# Altium schematic sheet GREENLED.SchDoc
size A
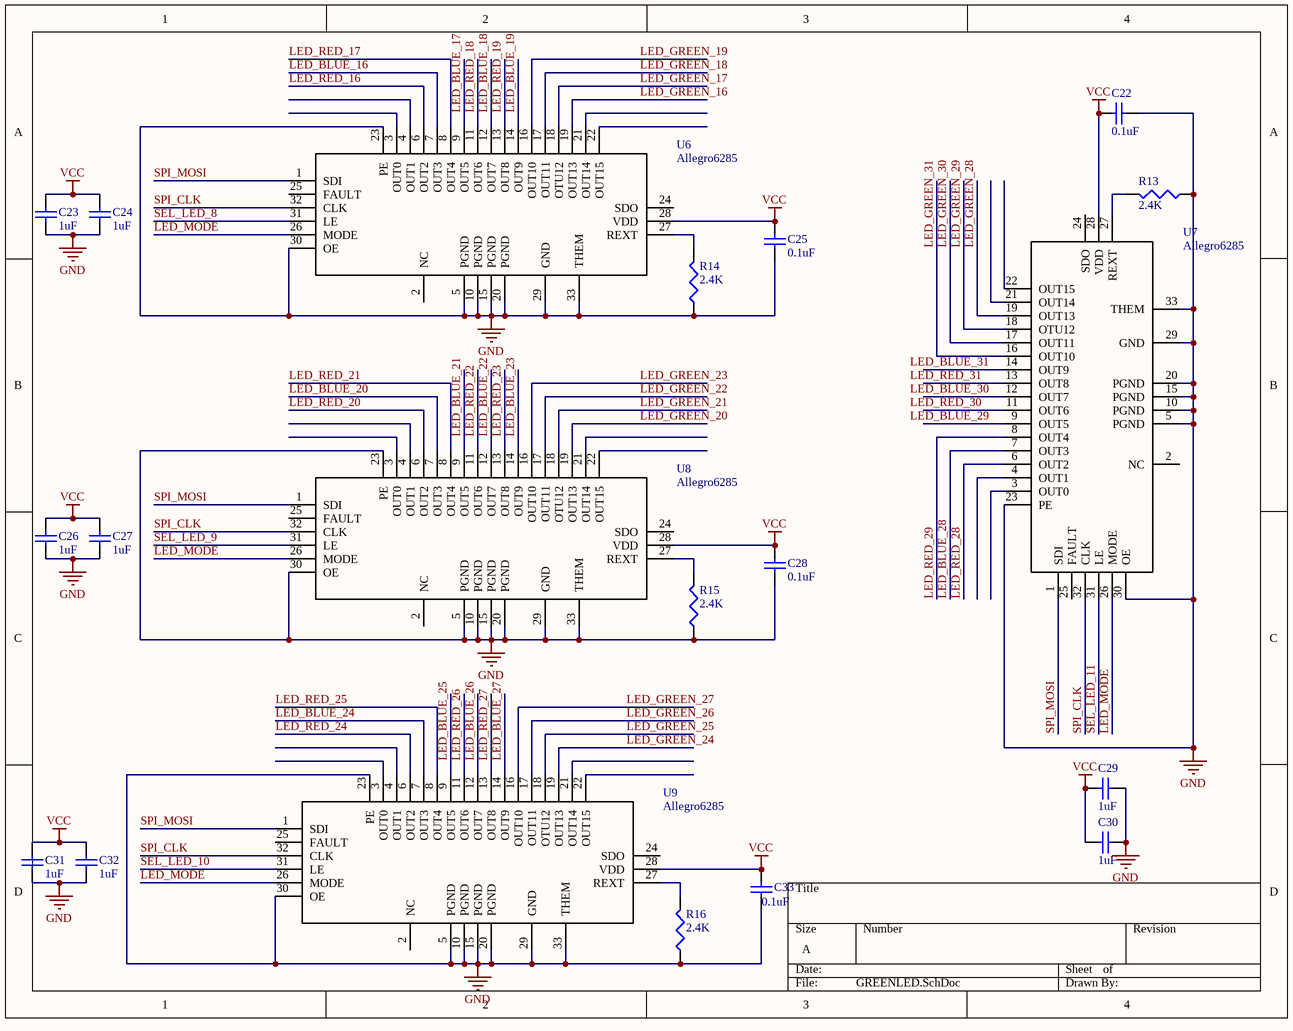
[diagram p0: GREENLED.SchDoc]

## Parts
C22  value 0.1uF  [CAPC1005L]  (hidden comment: Cap Semi)
C23  value 1uF  [CAPC1608L]  (hidden comment: Cap Semi)
C24  value 1uF  [CAPC1608L]  (hidden comment: Cap Semi)
C25  value 0.1uF  [CAPC1005L]  (hidden comment: Cap Semi)
C26  value 1uF  [CAPC1608L]  (hidden comment: Cap Semi)
C27  value 1uF  [CAPC1608L]  (hidden comment: Cap Semi)
C28  value 0.1uF  [CAPC1005L]  (hidden comment: Cap Semi)
C29  value 1uF  [CAPC1608L]  (hidden comment: Cap Semi)
C30  value 1uF  [CAPC1608L]  (hidden comment: Cap Semi)
C31  value 1uF  [CAPC1608L]  (hidden comment: Cap Semi)
C32  value 1uF  [CAPC1608L]  (hidden comment: Cap Semi)
C33  value 0.1uF  [CAPC1005L]  (hidden comment: Cap Semi)
R13  value 2.4K  [RESC1608L]  (hidden comment: Res3)
R14  value 2.4K  [RESC1608L]  (hidden comment: Res3)
R15  value 2.4K  [RESC1608L]  (hidden comment: Res3)
R16  value 2.4K  [RESC1608L]  (hidden comment: Res3)
U6  Allegro6285  [QFN-32]
U7  Allegro6285  [QFN-32]
U8  Allegro6285  [QFN-32]
U9  Allegro6285  [QFN-32]

## Nets
GND: C22.1 C23.1 C24.1 C25.1 C26.1 C27.1 C28.1 C29.1 C30.1 C31.1 C32.1 C33.1 R13.1 R14.1 R15.1 R16.1 U6.5(PGND) U6.10(PGND) U6.15(PGND) U6.20(PGND) U6.23(PE) U6.29(GND) U6.30(OE) U6.33(THEM) U7.5(PGND) U7.10(PGND) U7.15(PGND) U7.20(PGND) U7.23(PE) U7.29(GND) U7.30(OE) U7.33(THEM) U8.5(PGND) U8.10(PGND) U8.15(PGND) U8.20(PGND) U8.23(PE) U8.29(GND) U8.30(OE) U8.33(THEM) U9.5(PGND) U9.10(PGND) U9.15(PGND) U9.20(PGND) U9.23(PE) U9.29(GND) U9.30(OE) U9.33(THEM)
VCC: C22.2 C23.2 C24.2 C25.2 C26.2 C27.2 C28.2 C29.2 C30.2 C31.2 C32.2 C33.2 U6.28(VDD) U7.28(VDD) U8.28(VDD) U9.28(VDD)
LED_BLUE_16: U6.7(OUT3)
LED_BLUE_17: U6.9(OUT5)
LED_BLUE_18: U6.12(OUT7)
LED_BLUE_19: U6.14(OUT9)
LED_BLUE_20: U8.7(OUT3)
LED_BLUE_21: U8.9(OUT5)
LED_BLUE_22: U8.12(OUT7)
LED_BLUE_23: U8.14(OUT9)
LED_BLUE_24: U9.7(OUT3)
LED_BLUE_25: U9.9(OUT5)
LED_BLUE_26: U9.12(OUT7)
LED_BLUE_27: U9.14(OUT9)
LED_BLUE_28: U7.7(OUT3)
LED_GREEN_16: U6.19(OUT13)
LED_GREEN_17: U6.18(OTU12)
LED_GREEN_18: U6.17(OUT11)
LED_GREEN_19: U6.16(OUT10)
LED_GREEN_20: U8.19(OUT13)
LED_GREEN_21: U8.18(OTU12)
LED_GREEN_22: U8.17(OUT11)
LED_GREEN_23: U8.16(OUT10)
LED_GREEN_24: U9.19(OUT13)
LED_GREEN_25: U9.18(OTU12)
LED_GREEN_26: U9.17(OUT11)
LED_GREEN_27: U9.16(OUT10)
LED_GREEN_28: U7.19(OUT13)
LED_GREEN_29: U7.18(OTU12)
LED_GREEN_30: U7.17(OUT11)
LED_GREEN_31: U7.16(OUT10)
LED_MODE: U6.26(MODE) U7.26(MODE) U8.26(MODE) U9.26(MODE)
LED_RED_16: U6.6(OUT2)
LED_RED_17: U6.8(OUT4)
LED_RED_18: U6.11(OUT6)
LED_RED_19: U6.13(OUT8)
LED_RED_20: U8.6(OUT2)
LED_RED_21: U8.8(OUT4)
LED_RED_22: U8.11(OUT6)
LED_RED_23: U8.13(OUT8)
LED_RED_24: U9.6(OUT2)
LED_RED_25: U9.8(OUT4)
LED_RED_26: U9.11(OUT6)
LED_RED_27: U9.13(OUT8)
LED_RED_28: U7.6(OUT2)
LED_RED_29: U7.8(OUT4)
SEL_LED_8: U6.31(LE)
SEL_LED_9: U8.31(LE)
SEL_LED_10: U9.31(LE)
SEL_LED_11: U7.31(LE)
SPI_CLK: U6.32(CLK) U7.32(CLK) U8.32(CLK) U9.32(CLK)
SPI_MOSI: U6.1(SDI) U7.1(SDI) U8.1(SDI) U9.1(SDI)
NetR13_2: R13.2 U7.27(REXT)
NetR14_2: R14.2 U6.27(REXT)
NetR15_2: R15.2 U8.27(REXT)
NetR16_2: R16.2 U9.27(REXT)

Not connected (* = marked no-connect by the designer): U6 2(NC) 3(OUT0) 4(OUT1) 21(OUT14) 22(OUT15) 24(SDO) 25(FAULT); U7 2(NC) 3(OUT0) 4(OUT1) 9(OUT5) 11(OUT6) 12(OUT7) 13(OUT8) 14(OUT9) 21(OUT14) 22(OUT15) 24(SDO) 25(FAULT); U8 2(NC) 3(OUT0) 4(OUT1) 21(OUT14) 22(OUT15) 24(SDO) 25(FAULT); U9 2(NC) 3(OUT0) 4(OUT1) 21(OUT14) 22(OUT15) 24(SDO) 25(FAULT)

## Notes on the sheet
- Labels drawn without touching a wire or pin: LED_BLUE_29, LED_BLUE_30, LED_BLUE_31, LED_RED_30, LED_RED_31

## Library data of the parts
C22-C33 = Cap Semi: Capacitor (Semiconductor SIM Model); Published: 8-Jun-2000; LatestRevisionDate: 29-May-2009; LatestRevisionNote: IPC-7351 Footprint Added.; PackageReference: C1206; Publisher: Altium Limited; PackageDescription: Chip Capacitor
R13-R16 = Res3: Resistor; Published: 8-Jun-2000; LatestRevisionDate: 29-May-2009; LatestRevisionNote: IPC-7351 Footprint Added.; PackageReference: J1-0603; Publisher: Altium Limited; PackageDescription: Chip Resistor